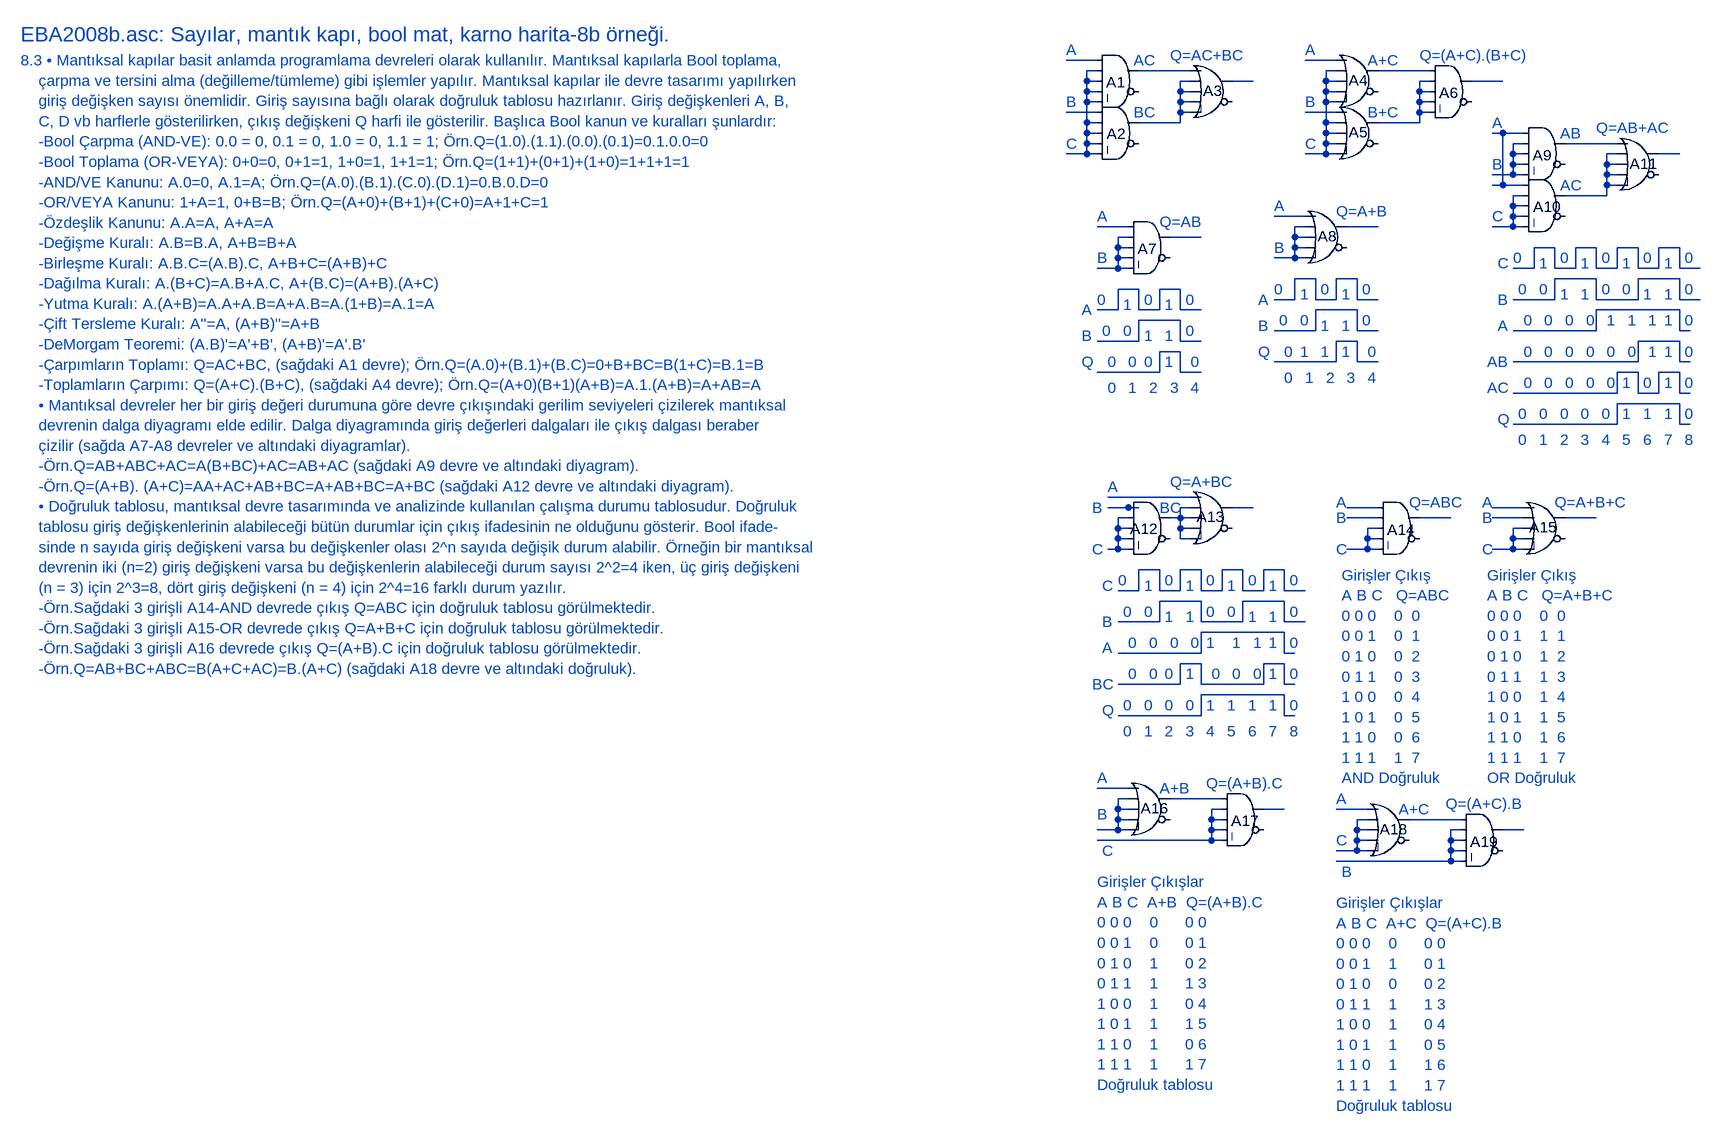
[diagram p0: schematic EBA2008b.asc]
EBA2008b.asc, the LTspice schematic file:
Version 4
SHEET 1 7064 4332
WIRE 1424 96 1376 96
WIRE 1792 96 1744 96
WIRE 1424 112 1408 112
WIRE 1568 112 1488 112
WIRE 1792 112 1776 112
WIRE 1936 112 1856 112
WIRE 1408 128 1408 112
WIRE 1424 128 1408 128
WIRE 1568 128 1552 128
WIRE 1664 128 1632 128
WIRE 1776 128 1776 112
WIRE 1792 128 1776 128
WIRE 1936 128 1920 128
WIRE 2048 128 2000 128
WIRE 1408 144 1408 128
WIRE 1424 144 1408 144
WIRE 1552 144 1552 128
WIRE 1568 144 1552 144
WIRE 1776 144 1776 128
WIRE 1792 144 1776 144
WIRE 1920 144 1920 128
WIRE 1936 144 1920 144
WIRE 1408 160 1408 144
WIRE 1424 160 1408 160
WIRE 1552 160 1552 144
WIRE 1568 160 1552 160
WIRE 1776 160 1776 144
WIRE 1792 160 1776 160
WIRE 1920 160 1920 144
WIRE 1936 160 1920 160
WIRE 1424 176 1376 176
WIRE 1552 176 1552 160
WIRE 1568 176 1552 176
WIRE 1792 176 1744 176
WIRE 1920 176 1920 160
WIRE 1936 176 1920 176
WIRE 1408 192 1408 160
WIRE 1424 192 1408 192
WIRE 1552 192 1552 176
WIRE 1552 192 1488 192
WIRE 1776 192 1776 160
WIRE 1792 192 1776 192
WIRE 1920 192 1920 176
WIRE 1920 192 1856 192
WIRE 1408 208 1408 192
WIRE 1424 208 1408 208
WIRE 1776 208 1776 192
WIRE 1792 208 1776 208
WIRE 2048 208 2032 208
WIRE 2080 208 2048 208
WIRE 1408 224 1408 208
WIRE 1424 224 1408 224
WIRE 1776 224 1776 208
WIRE 1792 224 1776 224
WIRE 2080 224 2064 224
WIRE 2224 224 2144 224
WIRE 1408 240 1408 224
WIRE 1408 240 1376 240
WIRE 1424 240 1408 240
WIRE 1776 240 1776 224
WIRE 1776 240 1744 240
WIRE 1792 240 1776 240
WIRE 2064 240 2064 224
WIRE 2080 240 2064 240
WIRE 2224 240 2208 240
WIRE 2320 240 2288 240
WIRE 2064 256 2064 240
WIRE 2080 256 2064 256
WIRE 2208 256 2208 240
WIRE 2224 256 2208 256
WIRE 2064 272 2064 256
WIRE 2064 272 2032 272
WIRE 2080 272 2064 272
WIRE 2208 272 2208 256
WIRE 2224 272 2208 272
WIRE 2048 288 2048 208
WIRE 2048 288 2032 288
WIRE 2080 288 2048 288
WIRE 2208 288 2208 272
WIRE 2224 288 2208 288
WIRE 2080 304 2064 304
WIRE 2208 304 2208 288
WIRE 2208 304 2144 304
WIRE 2064 320 2064 304
WIRE 2080 320 2064 320
WIRE 1744 336 1696 336
WIRE 2064 336 2064 320
WIRE 2080 336 2064 336
WIRE 1472 352 1424 352
WIRE 1744 352 1728 352
WIRE 1856 352 1808 352
WIRE 2064 352 2064 336
WIRE 2064 352 2032 352
WIRE 2080 352 2064 352
WIRE 1472 368 1456 368
WIRE 1584 368 1536 368
WIRE 1728 368 1728 352
WIRE 1744 368 1728 368
WIRE 1456 384 1456 368
WIRE 1472 384 1456 384
WIRE 1728 384 1728 368
WIRE 1744 384 1728 384
WIRE 2128 384 2096 384
WIRE 2192 384 2160 384
WIRE 2256 384 2224 384
WIRE 2320 384 2288 384
WIRE 1456 400 1456 384
WIRE 1472 400 1456 400
WIRE 1728 400 1728 384
WIRE 1728 400 1696 400
WIRE 1744 400 1728 400
WIRE 1456 416 1456 400
WIRE 1456 416 1424 416
WIRE 1472 416 1456 416
WIRE 2096 416 2096 384
WIRE 2096 416 2064 416
WIRE 2128 416 2128 384
WIRE 2160 416 2160 384
WIRE 2160 416 2128 416
WIRE 2192 416 2192 384
WIRE 2224 416 2224 384
WIRE 2224 416 2192 416
WIRE 2256 416 2256 384
WIRE 2288 416 2288 384
WIRE 2288 416 2256 416
WIRE 2320 416 2320 384
WIRE 2352 416 2320 416
WIRE 1760 432 1728 432
WIRE 1824 432 1792 432
WIRE 2192 432 2128 432
WIRE 2320 432 2256 432
WIRE 1488 448 1456 448
WIRE 1552 448 1520 448
WIRE 1728 464 1728 432
WIRE 1728 464 1696 464
WIRE 1760 464 1760 432
WIRE 1792 464 1792 432
WIRE 1792 464 1760 464
WIRE 1824 464 1824 432
WIRE 1856 464 1824 464
WIRE 2128 464 2128 432
WIRE 2128 464 2064 464
WIRE 2192 464 2192 432
WIRE 2256 464 2256 432
WIRE 2256 464 2192 464
WIRE 2320 464 2320 432
WIRE 2352 464 2320 464
WIRE 1456 480 1456 448
WIRE 1456 480 1424 480
WIRE 1488 480 1488 448
WIRE 1520 480 1520 448
WIRE 1520 480 1488 480
WIRE 1552 480 1552 448
WIRE 1584 480 1552 480
WIRE 1824 480 1760 480
WIRE 2320 480 2192 480
WIRE 1552 496 1488 496
WIRE 1760 512 1760 480
WIRE 1760 512 1696 512
WIRE 1824 512 1824 480
WIRE 1856 512 1824 512
WIRE 2192 512 2192 480
WIRE 2192 512 2064 512
WIRE 2320 512 2320 480
WIRE 2336 512 2320 512
WIRE 1488 528 1488 496
WIRE 1488 528 1424 528
WIRE 1552 528 1552 496
WIRE 1584 528 1552 528
WIRE 1824 528 1792 528
WIRE 2320 528 2256 528
WIRE 1552 544 1520 544
WIRE 1792 560 1792 528
WIRE 1792 560 1696 560
WIRE 1824 560 1824 528
WIRE 1856 560 1824 560
WIRE 2256 560 2256 528
WIRE 2256 560 2064 560
WIRE 2320 560 2320 528
WIRE 2336 560 2320 560
WIRE 1520 576 1520 544
WIRE 1520 576 1424 576
WIRE 1552 576 1552 544
WIRE 1584 576 1552 576
WIRE 2256 576 2224 576
WIRE 2320 576 2288 576
WIRE 2224 608 2224 576
WIRE 2224 608 2064 608
WIRE 2256 608 2256 576
WIRE 2288 608 2288 576
WIRE 2288 608 2256 608
WIRE 2320 608 2320 576
WIRE 2336 608 2320 608
WIRE 2320 624 2224 624
WIRE 2224 656 2224 624
WIRE 2224 656 2064 656
WIRE 2320 656 2320 624
WIRE 2336 656 2320 656
WIRE 1568 768 1440 768
WIRE 1472 784 1440 784
WIRE 1488 784 1472 784
WIRE 1568 784 1552 784
WIRE 1664 784 1632 784
WIRE 1856 784 1808 784
WIRE 2080 784 2032 784
WIRE 1472 800 1456 800
WIRE 1552 800 1552 784
WIRE 1552 800 1536 800
WIRE 1568 800 1552 800
WIRE 1856 800 1808 800
WIRE 1968 800 1920 800
WIRE 2080 800 2032 800
WIRE 2192 800 2144 800
WIRE 1456 816 1456 800
WIRE 1472 816 1456 816
WIRE 1552 816 1552 800
WIRE 1568 816 1552 816
WIRE 1856 816 1840 816
WIRE 2080 816 2064 816
WIRE 1456 832 1456 816
WIRE 1472 832 1456 832
WIRE 1552 832 1552 816
WIRE 1568 832 1552 832
WIRE 1840 832 1840 816
WIRE 1856 832 1840 832
WIRE 2064 832 2064 816
WIRE 2080 832 2064 832
WIRE 1456 848 1456 832
WIRE 1456 848 1440 848
WIRE 1472 848 1456 848
WIRE 1840 848 1840 832
WIRE 1840 848 1808 848
WIRE 1856 848 1840 848
WIRE 2064 848 2064 832
WIRE 2064 848 2032 848
WIRE 2080 848 2064 848
WIRE 1520 880 1488 880
WIRE 1584 880 1552 880
WIRE 1648 880 1616 880
WIRE 1712 880 1680 880
WIRE 1488 912 1488 880
WIRE 1488 912 1456 912
WIRE 1520 912 1520 880
WIRE 1552 912 1552 880
WIRE 1552 912 1520 912
WIRE 1584 912 1584 880
WIRE 1616 912 1616 880
WIRE 1616 912 1584 912
WIRE 1648 912 1648 880
WIRE 1680 912 1680 880
WIRE 1680 912 1648 912
WIRE 1712 912 1712 880
WIRE 1744 912 1712 912
WIRE 1584 928 1520 928
WIRE 1712 928 1648 928
WIRE 1520 960 1520 928
WIRE 1520 960 1456 960
WIRE 1584 960 1584 928
WIRE 1648 960 1648 928
WIRE 1648 960 1584 960
WIRE 1712 960 1712 928
WIRE 1744 960 1712 960
WIRE 1712 976 1584 976
WIRE 1584 1008 1584 976
WIRE 1584 1008 1456 1008
WIRE 1712 1008 1712 976
WIRE 1728 1008 1712 1008
WIRE 1584 1024 1552 1024
WIRE 1712 1024 1680 1024
WIRE 1552 1056 1552 1024
WIRE 1552 1056 1456 1056
WIRE 1584 1056 1584 1024
WIRE 1680 1056 1680 1024
WIRE 1680 1056 1584 1056
WIRE 1712 1056 1712 1024
WIRE 1728 1056 1712 1056
WIRE 1712 1072 1584 1072
WIRE 1584 1104 1584 1072
WIRE 1584 1104 1456 1104
WIRE 1712 1104 1712 1072
WIRE 1728 1104 1712 1104
WIRE 1472 1216 1424 1216
WIRE 1472 1232 1456 1232
WIRE 1616 1232 1536 1232
WIRE 1456 1248 1456 1232
WIRE 1472 1248 1456 1248
WIRE 1616 1248 1600 1248
WIRE 1712 1248 1680 1248
WIRE 1840 1248 1792 1248
WIRE 1456 1264 1456 1248
WIRE 1472 1264 1456 1264
WIRE 1600 1264 1600 1248
WIRE 1616 1264 1600 1264
WIRE 1840 1264 1824 1264
WIRE 1984 1264 1904 1264
WIRE 1456 1280 1456 1264
WIRE 1456 1280 1424 1280
WIRE 1472 1280 1456 1280
WIRE 1600 1280 1600 1264
WIRE 1616 1280 1600 1280
WIRE 1824 1280 1824 1264
WIRE 1840 1280 1824 1280
WIRE 1984 1280 1968 1280
WIRE 2080 1280 2048 1280
WIRE 1600 1296 1600 1280
WIRE 1600 1296 1424 1296
WIRE 1616 1296 1600 1296
WIRE 1824 1296 1824 1280
WIRE 1840 1296 1824 1296
WIRE 1968 1296 1968 1280
WIRE 1984 1296 1968 1296
WIRE 1824 1312 1824 1296
WIRE 1824 1312 1792 1312
WIRE 1840 1312 1824 1312
WIRE 1968 1312 1968 1296
WIRE 1984 1312 1968 1312
WIRE 1968 1328 1968 1312
WIRE 1968 1328 1792 1328
WIRE 1984 1328 1968 1328
SYMBOL Digital\\and 1456 64 R0
WINDOW 0 -18 66 Left 2
SYMATTR InstName A1
SYMBOL Digital\\and 1456 144 R0
WINDOW 0 -17 65 Left 2
SYMATTR InstName A2
SYMBOL Digital\\or 1600 80 R0
WINDOW 0 -13 63 Left 2
SYMATTR InstName A3
SYMBOL Digital\\or 1824 64 R0
WINDOW 0 -13 63 Left 2
SYMATTR InstName A4
SYMBOL Digital\\or 1824 144 R0
WINDOW 0 -13 63 Left 2
SYMATTR InstName A5
SYMBOL Digital\\and 1968 80 R0
WINDOW 0 -18 66 Left 2
SYMATTR InstName A6
SYMBOL Digital\\and 1504 320 R0
WINDOW 0 -18 66 Left 2
SYMATTR InstName A7
SYMBOL Digital\\or 1776 304 R0
WINDOW 0 -13 63 Left 2
SYMATTR InstName A8
SYMBOL Digital\\and 2112 176 R0
WINDOW 0 -18 66 Left 2
SYMATTR InstName A9
SYMBOL Digital\\and 2112 256 R0
WINDOW 0 -17 65 Left 2
SYMATTR InstName A10
SYMBOL Digital\\or 2256 192 R0
WINDOW 0 -13 63 Left 2
SYMATTR InstName A11
SYMBOL Digital\\and 1504 752 R0
WINDOW 0 -29 65 Left 2
SYMATTR InstName A12
SYMBOL Digital\\or 1600 736 R0
WINDOW 0 -23 62 Left 2
SYMATTR InstName A13
SYMBOL Digital\\and 1888 752 R0
WINDOW 0 -18 66 Left 2
SYMATTR InstName A14
SYMBOL Digital\\or 2112 752 R0
WINDOW 0 -23 62 Left 2
SYMATTR InstName A15
SYMBOL Digital\\or 1504 1184 R0
WINDOW 0 -13 63 Left 2
SYMATTR InstName A16
SYMBOL Digital\\and 1648 1200 R0
WINDOW 0 -18 66 Left 2
SYMATTR InstName A17
SYMBOL Digital\\or 1872 1216 R0
WINDOW 0 -13 63 Left 2
SYMATTR InstName A18
SYMBOL Digital\\and 2016 1232 R0
WINDOW 0 -18 66 Left 2
SYMATTR InstName A19
TEXT -232 56 Left 3 ;EBA2008b.asc: Sayılar, mantık kapı, bool mat, karno harita-8b örneği.
TEXT -232 96 Left 2 ;8.3 • Mantıksal kapılar basit anlamda programlama devreleri olarak kullanılır. Mantıksal kapılarla Bool toplama, \n    çarpma ve tersini alma (değilleme/tümleme) gibi işlemler yapılır. Mantıksal kapılar ile devre tasarımı yapılırken \n    giriş değişken sayısı önemlidir. Giriş sayısına bağlı olarak doğruluk tablosu hazırlanır. Giriş değişkenleri A, B, \n    C, D vb harflerle gösterilirken, çıkış değişkeni Q harfi ile gösterilir. Başlıca Bool kanun ve kuralları şunlardır:\n    -Bool Çarpma (AND-VE): 0.0 = 0, 0.1 = 0, 1.0 = 0, 1.1 = 1; Örn.Q=(1.0).(1.1).(0.0).(0.1)=0.1.0.0=0\n    -Bool Toplama (OR-VEYA): 0+0=0, 0+1=1, 1+0=1, 1+1=1; Örn.Q=(1+1)+(0+1)+(1+0)=1+1+1=1\n    -AND/VE Kanunu: A.0=0, A.1=A; Örn.Q=(A.0).(B.1).(C.0).(D.1)=0.B.0.D=0\n    -OR/VEYA Kanunu: 1+A=1, 0+B=B; Örn.Q=(A+0)+(B+1)+(C+0)=A+1+C=1\n    -Özdeşlik Kanunu: A.A=A, A+A=A\n    -Değişme Kuralı: A.B=B.A, A+B=B+A\n    -Birleşme Kuralı: A.B.C=(A.B).C, A+B+C=(A+B)+C\n    -Dağılma Kuralı: A.(B+C)=A.B+A.C, A+(B.C)=(A+B).(A+C)\n    -Yutma Kuralı: A.(A+B)=A.A+A.B=A+A.B=A.(1+B)=A.1=A\n    -Çift Tersleme Kuralı: A''=A, (A+B)''=A+B\n    -DeMorgam Teoremi: (A.B)'=A'+B', (A+B)'=A'.B'\n    -Çarpımların Toplamı: Q=AC+BC, (sağdaki A1 devre); Örn.Q=(A.0)+(B.1)+(B.C)=0+B+BC=B(1+C)=B.1=B\n    -Toplamların Çarpımı: Q=(A+C).(B+C), (sağdaki A4 devre); Örn.Q=(A+0)(B+1)(A+B)=A.1.(A+B)=A+AB=A\n    • Mantıksal devreler her bir giriş değeri durumuna göre devre çıkışındaki gerilim seviyeleri çizilerek mantıksal \n    devrenin dalga diyagramı elde edilir. Dalga diyagramında giriş değerleri dalgaları ile çıkış dalgası beraber \n    çizilir (sağda A7-A8 devreler ve altındaki diyagramlar).\n    -Örn.Q=AB+ABC+AC=A(B+BC)+AC=AB+AC (sağdaki A9 devre ve altındaki diyagram).\n    -Örn.Q=(A+B). (A+C)=AA+AC+AB+BC=A+AB+BC=A+BC (sağdaki A12 devre ve altındaki diyagram).\n    • Doğruluk tablosu, mantıksal devre tasarımında ve analizinde kullanılan çalışma durumu tablosudur. Doğruluk\n    tablosu giriş değişkenlerinin alabileceği bütün durumlar için çıkış ifadesinin ne olduğunu gösterir. Bool ifade-\n    sinde n sayıda giriş değişkeni varsa bu değişkenler olası 2^n sayıda değişik durum alabilir. Örneğin bir mantıksal \n    devrenin iki (n=2) giriş değişkeni varsa bu değişkenlerin alabileceği durum sayısı 2^2=4 iken, üç giriş değişkeni \n    (n = 3) için 2^3=8, dört giriş değişkeni (n = 4) için 2^4=16 farklı durum yazılır.\n    -Örn.Sağdaki 3 girişli A14-AND devrede çıkış Q=ABC için doğruluk tablosu görülmektedir.\n    -Örn.Sağdaki 3 girişli A15-OR devrede çıkış Q=A+B+C için doğruluk tablosu görülmektedir.\n    -Örn.Sağdaki 3 girişli A16 devrede çıkış Q=(A+B).C için doğruluk tablosu görülmektedir.\n    -Örn.Q=AB+BC+ABC=B(A+C+AC)=B.(A+C) (sağdaki A18 devre ve altındaki doğruluk).
TEXT 1376 80 Left 2 ;A
TEXT 1376 160 Left 2 ;B
TEXT 1376 224 Left 2 ;C
TEXT 1480 96 Left 2 ;AC
TEXT 1480 176 Left 2 ;BC
TEXT 1536 88 Left 2 ;Q=AC+BC
TEXT 1744 80 Left 2 ;A
TEXT 1744 160 Left 2 ;B
TEXT 1744 224 Left 2 ;C
TEXT 1840 96 Left 2 ;A+C
TEXT 1840 176 Left 2 ;B+C
TEXT 1920 88 Left 2 ;Q=(A+C).(B+C)
TEXT 1424 336 Left 2 ;A
TEXT 1424 400 Left 2 ;B
TEXT 1520 344 Left 2 ;Q=AB
TEXT 1400 480 Left 2 ;A
TEXT 1400 520 Left 2 ;B
TEXT 1424 464 Left 2 ;0
TEXT 1496 464 Left 2 ;0
TEXT 1560 464 Left 2 ;0
TEXT 1464 472 Left 2 ;1
TEXT 1528 472 Left 2 ;1
TEXT 1432 512 Left 2 ;0
TEXT 1464 512 Left 2 ;0
TEXT 1496 520 Left 2 ;1
TEXT 1528 520 Left 2 ;1
TEXT 1560 512 Left 2 ;0
TEXT 1400 560 Left 2 ;Q
TEXT 1440 560 Left 2 ;0
TEXT 1472 560 Left 2 ;0
TEXT 1496 560 Left 2 ;0
TEXT 1528 560 Left 2 ;1
TEXT 1568 560 Left 2 ;0
TEXT 1440 600 Left 2 ;0
TEXT 1472 600 Left 2 ;1
TEXT 1504 600 Left 2 ;2
TEXT 1536 600 Left 2 ;3
TEXT 1568 600 Left 2 ;4
TEXT 1696 320 Left 2 ;A
TEXT 1696 384 Left 2 ;B
TEXT 1792 328 Left 2 ;Q=A+B
TEXT 1672 464 Left 2 ;A
TEXT 1672 504 Left 2 ;B
TEXT 1696 448 Left 2 ;0
TEXT 1768 448 Left 2 ;0
TEXT 1832 448 Left 2 ;0
TEXT 1736 456 Left 2 ;1
TEXT 1800 456 Left 2 ;1
TEXT 1704 496 Left 2 ;0
TEXT 1736 496 Left 2 ;0
TEXT 1768 504 Left 2 ;1
TEXT 1800 504 Left 2 ;1
TEXT 1832 496 Left 2 ;0
TEXT 1672 544 Left 2 ;Q
TEXT 1712 544 Left 2 ;0
TEXT 1800 544 Left 2 ;1
TEXT 1840 544 Left 2 ;0
TEXT 1712 584 Left 2 ;0
TEXT 1744 584 Left 2 ;1
TEXT 1776 584 Left 2 ;2
TEXT 1808 584 Left 2 ;3
TEXT 1840 584 Left 2 ;4
TEXT 1736 544 Left 2 ;1
TEXT 1768 544 Left 2 ;1
TEXT 2032 192 Left 2 ;A
TEXT 2032 256 Left 2 ;B
TEXT 2032 336 Left 2 ;C
TEXT 2136 208 Left 2 ;AB
TEXT 2136 288 Left 2 ;AC
TEXT 2192 200 Left 2 ;Q=AB+AC
TEXT 2040 504 Left 2 ;A
TEXT 2040 464 Left 2 ;B
TEXT 2064 400 Left 2 ;0
TEXT 2136 400 Left 2 ;0
TEXT 2104 408 Left 2 ;1
TEXT 2168 408 Left 2 ;1
TEXT 2072 448 Left 2 ;0
TEXT 2104 448 Left 2 ;0
TEXT 2136 456 Left 2 ;1
TEXT 2168 456 Left 2 ;1
TEXT 2200 400 Left 2 ;0
TEXT 2264 400 Left 2 ;0
TEXT 2328 400 Left 2 ;0
TEXT 2232 408 Left 2 ;1
TEXT 2296 408 Left 2 ;1
TEXT 2200 448 Left 2 ;0
TEXT 2232 448 Left 2 ;0
TEXT 2264 456 Left 2 ;1
TEXT 2296 456 Left 2 ;1
TEXT 2328 448 Left 2 ;0
TEXT 2328 496 Left 2 ;0
TEXT 2296 496 Left 2 ;1
TEXT 2272 496 Left 2 ;1
TEXT 2240 496 Left 2 ;1
TEXT 2208 496 Left 2 ;1
TEXT 2176 496 Left 2 ;0
TEXT 2144 496 Left 2 ;0
TEXT 2112 496 Left 2 ;0
TEXT 2080 496 Left 2 ;0
TEXT 2040 408 Left 2 ;C
TEXT 2328 544 Left 2 ;0
TEXT 2296 544 Left 2 ;1
TEXT 2272 544 Left 2 ;1
TEXT 2240 544 Left 2 ;0
TEXT 2208 544 Left 2 ;0
TEXT 2176 544 Left 2 ;0
TEXT 2144 544 Left 2 ;0
TEXT 2112 544 Left 2 ;0
TEXT 2080 544 Left 2 ;0
TEXT 2024 560 Left 2 ;AB
TEXT 2328 592 Left 2 ;0
TEXT 2296 592 Left 2 ;1
TEXT 2232 592 Left 2 ;1
TEXT 2264 592 Left 2 ;0
TEXT 2208 592 Left 2 ;0
TEXT 2176 592 Left 2 ;0
TEXT 2144 592 Left 2 ;0
TEXT 2112 592 Left 2 ;0
TEXT 2040 648 Left 2 ;Q
TEXT 2080 592 Left 2 ;0
TEXT 2024 600 Left 2 ;AC
TEXT 2328 640 Left 2 ;0
TEXT 2296 640 Left 2 ;1
TEXT 2264 640 Left 2 ;1
TEXT 2232 640 Left 2 ;1
TEXT 2200 640 Left 2 ;0
TEXT 2168 640 Left 2 ;0
TEXT 2136 640 Left 2 ;0
TEXT 2104 640 Left 2 ;0
TEXT 2072 640 Left 2 ;0
TEXT 2072 680 Left 2 ;0
TEXT 2104 680 Left 2 ;1
TEXT 2136 680 Left 2 ;2
TEXT 2168 680 Left 2 ;3
TEXT 2200 680 Left 2 ;4
TEXT 2232 680 Left 2 ;5
TEXT 2264 680 Left 2 ;6
TEXT 2296 680 Left 2 ;7
TEXT 2328 680 Left 2 ;8
TEXT 1440 752 Left 2 ;A
TEXT 1416 848 Left 2 ;C
TEXT 1520 784 Left 2 ;BC
TEXT 1536 744 Left 2 ;Q=A+BC
TEXT 1432 1000 Left 2 ;A
TEXT 1432 960 Left 2 ;B
TEXT 1456 896 Left 2 ;0
TEXT 1528 896 Left 2 ;0
TEXT 1496 904 Left 2 ;1
TEXT 1560 904 Left 2 ;1
TEXT 1464 944 Left 2 ;0
TEXT 1496 944 Left 2 ;0
TEXT 1528 952 Left 2 ;1
TEXT 1560 952 Left 2 ;1
TEXT 1592 896 Left 2 ;0
TEXT 1656 896 Left 2 ;0
TEXT 1720 896 Left 2 ;0
TEXT 1624 904 Left 2 ;1
TEXT 1688 904 Left 2 ;1
TEXT 1592 944 Left 2 ;0
TEXT 1624 944 Left 2 ;0
TEXT 1656 952 Left 2 ;1
TEXT 1688 952 Left 2 ;1
TEXT 1720 944 Left 2 ;0
TEXT 1720 992 Left 2 ;0
TEXT 1688 992 Left 2 ;1
TEXT 1664 992 Left 2 ;1
TEXT 1632 992 Left 2 ;1
TEXT 1592 992 Left 2 ;1
TEXT 1568 992 Left 2 ;0
TEXT 1536 992 Left 2 ;0
TEXT 1504 992 Left 2 ;0
TEXT 1472 992 Left 2 ;0
TEXT 1432 904 Left 2 ;C
TEXT 1416 1056 Left 2 ;BC
TEXT 1432 1096 Left 2 ;Q
TEXT 1720 1088 Left 2 ;0
TEXT 1688 1088 Left 2 ;1
TEXT 1656 1088 Left 2 ;1
TEXT 1624 1088 Left 2 ;1
TEXT 1560 1088 Left 2 ;0
TEXT 1528 1088 Left 2 ;0
TEXT 1496 1088 Left 2 ;0
TEXT 1464 1088 Left 2 ;0
TEXT 1464 1128 Left 2 ;0
TEXT 1496 1128 Left 2 ;1
TEXT 1528 1128 Left 2 ;2
TEXT 1560 1128 Left 2 ;3
TEXT 1592 1128 Left 2 ;4
TEXT 1624 1128 Left 2 ;5
TEXT 1656 1128 Left 2 ;6
TEXT 1688 1128 Left 2 ;7
TEXT 1720 1128 Left 2 ;8
TEXT 1416 784 Left 2 ;B
TEXT 1688 1040 Left 2 ;1
TEXT 1560 1040 Left 2 ;1
TEXT 1720 1040 Left 2 ;0
TEXT 1664 1040 Left 2 ;0
TEXT 1632 1040 Left 2 ;0
TEXT 1600 1040 Left 2 ;0
TEXT 1528 1040 Left 2 ;0
TEXT 1504 1040 Left 2 ;0
TEXT 1472 1040 Left 2 ;0
TEXT 1592 1088 Left 2 ;1
TEXT 1792 776 Left 2 ;A
TEXT 1792 800 Left 2 ;B
TEXT 1904 776 Left 2 ;Q=ABC
TEXT 1792 848 Left 2 ;C
TEXT 1800 888 Left 2 ;Girişler Çıkış\nA B C   Q=ABC\n0 0 0    0  0\n0 0 1    0  1\n0 1 0    0  2\n0 1 1    0  3\n1 0 0    0  4\n1 0 1    0  5\n1 1 0    0  6\n1 1 1    1  7\nAND Doğruluk
TEXT 2016 776 Left 2 ;A
TEXT 2016 800 Left 2 ;B
TEXT 2128 776 Left 2 ;Q=A+B+C
TEXT 2016 848 Left 2 ;C
TEXT 2024 888 Left 2 ;Girişler Çıkış\nA B C   Q=A+B+C\n0 0 0    0  0\n0 0 1    1  1\n0 1 0    1  2\n0 1 1    1  3\n1 0 0    1  4\n1 0 1    1  5\n1 1 0    1  6\n1 1 1    1  7\nOR Doğruluk
TEXT 1424 1200 Left 2 ;A
TEXT 1424 1256 Left 2 ;B
TEXT 1432 1312 Left 2 ;C
TEXT 1520 1216 Left 2 ;A+B
TEXT 1592 1208 Left 2 ;Q=(A+B).C
TEXT 1424 1360 Left 2 ;Girişler Çıkışlar\nA B C  A+B  Q=(A+B).C\n0 0 0    0      0 0\n0 0 1    0      0 1\n0 1 0    1      0 2\n0 1 1    1      1 3\n1 0 0    1      0 4\n1 0 1    1      1 5\n1 1 0    1      0 6\n1 1 1    1      1 7\nDoğruluk tablosu
TEXT 1792 1232 Left 2 ;A
TEXT 1800 1344 Left 2 ;B
TEXT 1792 1296 Left 2 ;C
TEXT 1888 1248 Left 2 ;A+C
TEXT 1960 1240 Left 2 ;Q=(A+C).B
TEXT 1792 1392 Left 2 ;Girişler Çıkışlar\nA B C  A+C  Q=(A+C).B\n0 0 0    0      0 0\n0 0 1    1      0 1\n0 1 0    0      0 2\n0 1 1    1      1 3\n1 0 0    1      0 4\n1 0 1    1      0 5\n1 1 0    1      1 6\n1 1 1    1      1 7\nDoğruluk tablosu

The netlist it stands for:
* EBA2008b.asc
A1 N001 N003 N003 N003 N003 0 N004 0 AND
A2 N011 N003 N003 N003 N003 0 N007 0 AND
A3 N004 N007 N007 N007 N007 0 N008 0 OR
A4 N002 N005 N005 N005 N005 0 N006 0 OR
A5 N012 N005 N005 N005 N005 0 N009 0 OR
A6 N006 N009 N009 N009 N009 0 N010 0 AND
A7 N020 N023 N023 N023 N023 0 N024 0 AND
A8 N019 N021 N021 N021 N021 0 N022 0 OR
A9 N013 N014 N014 N014 N014 0 N015 0 AND
A10 N013 N018 N018 N018 N018 0 N016 0 AND
A11 N015 N016 N016 N016 N016 0 N017 0 OR
A12 N038 N043 N043 N043 N043 0 N039 0 AND
A13 N037 N039 N039 N039 N039 0 N040 0 OR
A14 N041 N044 N048 N048 N048 0 N045 0 AND
A15 N042 N046 N049 N049 N049 0 N047 0 OR
A16 N055 N056 N056 N056 N056 0 N057 0 OR
A17 N057 N058 N058 N058 N058 0 N059 0 AND
A18 N060 N061 N061 N061 N061 0 N062 0 OR
A19 N062 N063 N063 N063 N063 0 N064 0 AND
* EBA2008b.asc: Sayılar, mantık kapı, bool mat, karno harita-8b örneği.
* 8.3 • Mantıksal kapılar basit anlamda programlama devreleri olarak kullanılır. Mantıksal kapılarla Bool toplama,
*     çarpma ve tersini alma (değilleme/tümleme) gibi işlemler yapılır. Mantıksal kapılar ile devre tasarımı yapılırken
*     giriş değişken sayısı önemlidir. Giriş sayısına bağlı olarak doğruluk tablosu hazırlanır. Giriş değişkenleri A, B,
*     C, D vb harflerle gösterilirken, çıkış değişkeni Q harfi ile gösterilir. Başlıca Bool kanun ve kuralları şunlardır:
*     -Bool Çarpma (AND-VE): 0.0 = 0, 0.1 = 0, 1.0 = 0, 1.1 = 1; Örn.Q=(1.0).(1.1).(0.0).(0.1)=0.1.0.0=0
*     -Bool Toplama (OR-VEYA): 0+0=0, 0+1=1, 1+0=1, 1+1=1; Örn.Q=(1+1)+(0+1)+(1+0)=1+1+1=1
*     -AND/VE Kanunu: A.0=0, A.1=A; Örn.Q=(A.0).(B.1).(C.0).(D.1)=0.B.0.D=0
*     -OR/VEYA Kanunu: 1+A=1, 0+B=B; Örn.Q=(A+0)+(B+1)+(C+0)=A+1+C=1
*     -Özdeşlik Kanunu: A.A=A, A+A=A
*     -Değişme Kuralı: A.B=B.A, A+B=B+A
*     -Birleşme Kuralı: A.B.C=(A.B).C, A+B+C=(A+B)+C
*     -Dağılma Kuralı: A.(B+C)=A.B+A.C, A+(B.C)=(A+B).(A+C)
*     -Yutma Kuralı: A.(A+B)=A.A+A.B=A+A.B=A.(1+B)=A.1=A
*     -Çift Tersleme Kuralı: A''=A, (A+B)''=A+B
*     -DeMorgam Teoremi: (A.B)'=A'+B', (A+B)'=A'.B'
*     -Çarpımların Toplamı: Q=AC+BC, (sağdaki A1 devre); Örn.Q=(A.0)+(B.1)+(B.C)=0+B+BC=B(1+C)=B.1=B
*     -Toplamların Çarpımı: Q=(A+C).(B+C), (sağdaki A4 devre); Örn.Q=(A+0)(B+1)(A+B)=A.1.(A+B)=A+AB=A
*     • Mantıksal devreler her bir giriş değeri durumuna göre devre çıkışındaki gerilim seviyeleri çizilerek mantıksal
*     devrenin dalga diyagramı elde edilir. Dalga diyagramında giriş değerleri dalgaları ile çıkış dalgası beraber
*     çizilir (sağda A7-A8 devreler ve altındaki diyagramlar).
*     -Örn.Q=AB+ABC+AC=A(B+BC)+AC=AB+AC (sağdaki A9 devre ve altındaki diyagram).
*     -Örn.Q=(A+B). (A+C)=AA+AC+AB+BC=A+AB+BC=A+BC (sağdaki A12 devre ve altındaki diyagram).
*     • Doğruluk tablosu, mantıksal devre tasarımında ve analizinde kullanılan çalışma durumu tablosudur. Doğruluk
*     tablosu giriş değişkenlerinin alabileceği bütün durumlar için çıkış ifadesinin ne olduğunu gösterir. Bool ifade-
*     sinde n sayıda giriş değişkeni varsa bu değişkenler olası 2^n sayıda değişik durum alabilir. Örneğin bir mantıksal
*     devrenin iki (n=2) giriş değişkeni varsa bu değişkenlerin alabileceği durum sayısı 2^2=4 iken, üç giriş değişkeni
*     (n = 3) için 2^3=8, dört giriş değişkeni (n = 4) için 2^4=16 farklı durum yazılır.
*     -Örn.Sağdaki 3 girişli A14-AND devrede çıkış Q=ABC için doğruluk tablosu görülmektedir.
*     -Örn.Sağdaki 3 girişli A15-OR devrede çıkış Q=A+B+C için doğruluk tablosu görülmektedir.
*     -Örn.Sağdaki 3 girişli A16 devrede çıkış Q=(A+B).C için doğruluk tablosu görülmektedir.
*     -Örn.Q=AB+BC+ABC=B(A+C+AC)=B.(A+C) (sağdaki A18 devre ve altındaki doğruluk).
* A
* B
* C
* AC
* BC
* Q=AC+BC
* A
* B
* C
* A+C
* B+C
* Q=(A+C).(B+C)
* A
* B
* Q=AB
* A
* B
* 0
* 0
* 0
* 1
* 1
* 0
* 0
* 1
* 1
* 0
* Q
* 0
* 0
* 0
* 1
* 0
* 0
* 1
* 2
* 3
* 4
* A
* B
* Q=A+B
* A
* B
* 0
* 0
* 0
* 1
* 1
* 0
* 0
* 1
* 1
* 0
* Q
* 0
* 1
* 0
* 0
* 1
* 2
* 3
* 4
* 1
* 1
* A
* B
* C
* AB
* AC
* Q=AB+AC
* A
* B
* 0
* 0
* 1
* 1
* 0
* 0
* 1
* 1
* 0
* 0
* 0
* 1
* 1
* 0
* 0
* 1
* 1
* 0
* 0
* 1
* 1
* 1
* 1
* 0
* 0
* 0
* 0
* C
* 0
* 1
* 1
* 0
* 0
* 0
* 0
* 0
* 0
* AB
* 0
* 1
* 1
* 0
* 0
* 0
* 0
* 0
* Q
* 0
* AC
* 0
* 1
* 1
* 1
* 0
* 0
* 0
* 0
* 0
* 0
* 1
* 2
* 3
* 4
* 5
* 6
* 7
* 8
* A
* C
* BC
* Q=A+BC
* A
* B
* 0
* 0
* 1
* 1
* 0
* 0
* 1
* 1
* 0
* 0
* 0
* 1
* 1
* 0
* 0
* 1
* 1
* 0
* 0
* 1
* 1
* 1
* 1
* 0
* 0
* 0
* 0
* C
* BC
* Q
* 0
* 1
* 1
* 1
* 0
* 0
* 0
* 0
* 0
* 1
* 2
* 3
* 4
* 5
* 6
* 7
* 8
* B
* 1
* 1
* 0
* 0
* 0
* 0
* 0
* 0
* 0
* 1
* A
* B
* Q=ABC
* C
* Girişler Çıkış
* A B C   Q=ABC
* 0 0 0    0  0
* 0 0 1    0  1
* 0 1 0    0  2
* 0 1 1    0  3
* 1 0 0    0  4
* 1 0 1    0  5
* 1 1 0    0  6
* 1 1 1    1  7
* AND Doğruluk
* A
* B
* Q=A+B+C
* C
* Girişler Çıkış
* A B C   Q=A+B+C
* 0 0 0    0  0
* 0 0 1    1  1
* 0 1 0    1  2
* 0 1 1    1  3
* 1 0 0    1  4
* 1 0 1    1  5
* 1 1 0    1  6
* 1 1 1    1  7
* OR Doğruluk
* A
* B
* C
* A+B
* Q=(A+B).C
* Girişler Çıkışlar
* A B C  A+B  Q=(A+B).C
* 0 0 0    0      0 0
* 0 0 1    0      0 1
* 0 1 0    1      0 2
* 0 1 1    1      1 3
* 1 0 0    1      0 4
* 1 0 1    1      1 5
* 1 1 0    1      0 6
* 1 1 1    1      1 7
* Doğruluk tablosu
* A
* B
* C
* A+C
* Q=(A+C).B
* Girişler Çıkışlar
* A B C  A+C  Q=(A+C).B
* 0 0 0    0      0 0
* 0 0 1    1      0 1
* 0 1 0    0      0 2
* 0 1 1    1      1 3
* 1 0 0    1      0 4
* 1 0 1    1      0 5
* 1 1 0    1      1 6
* 1 1 1    1      1 7
* Doğruluk tablosu
.backanno
.end